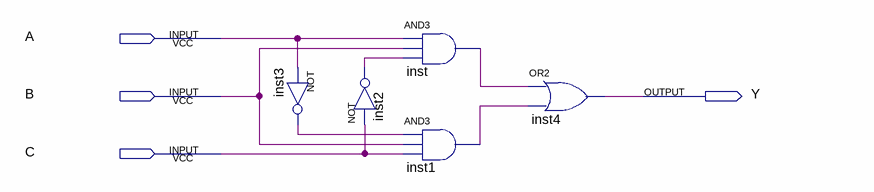
[diagram p0: schematic sheet]
// Quartus schematic Detector_Circuit.bdf as structural Verilog: 5 symbols, 4 pins
module Detector_Circuit (
  input  A,
  input  B,
  input  C,
  output Y
);

  wire inst1_out, inst2_out, inst3_out, inst_out;

  not inst3 (inst3_out, A);
  and inst (inst_out, A, B, inst2_out);
  not inst2 (inst2_out, C);
  and inst1 (inst1_out, inst3_out, B, C);
  or inst4 (Y, inst_out, inst1_out);
endmodule
